# Altium project FMC_DAC_1_5GS_4CH.PrjPCB (part 1 of 4)
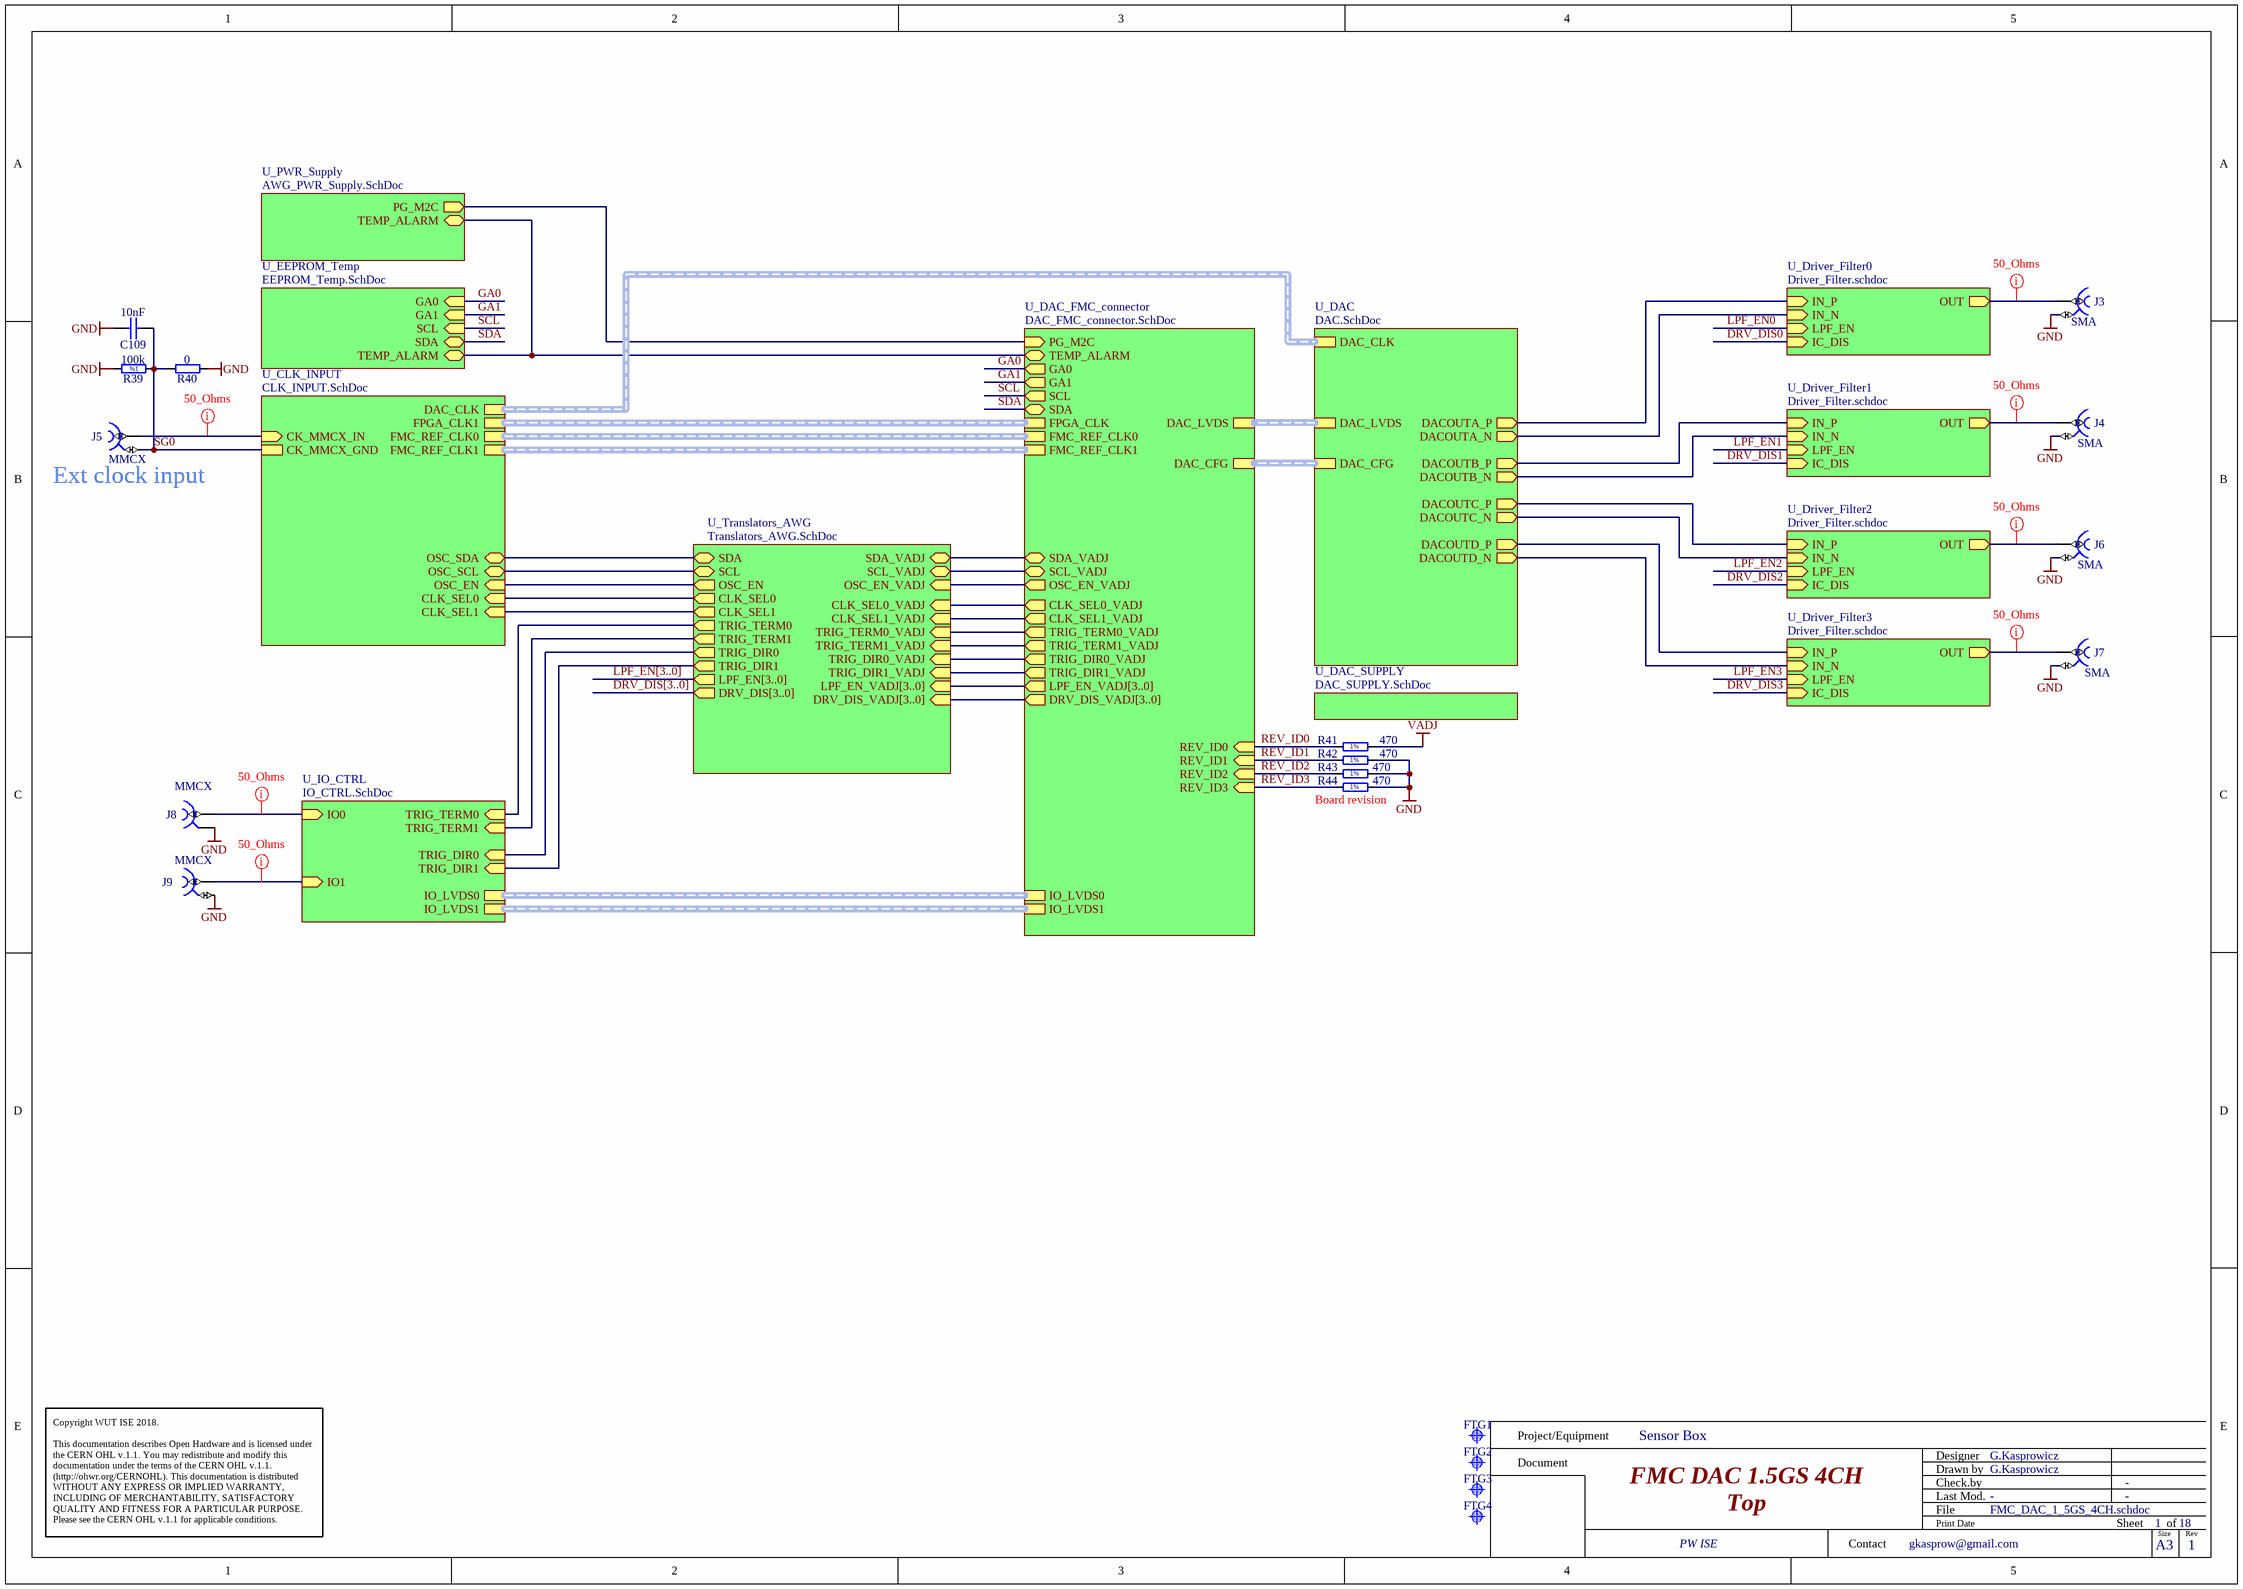
[diagram p0: FMC_DAC_1_5GS_4CH.schdoc]
10 sheets, 355 parts. Net scope: hierarchical (ports join the sheet entries above them; power ports are global).
Board file: FMC_DAC_1_5GS_4CH.PcbDoc
Sheets:
  FMC_DAC_1_5GS_4CH.schdoc
    U_PWR_Supply = AWG_PWR_Supply.SchDoc
    U_CLK_INPUT = CLK_INPUT.SchDoc
    U_DAC = DAC.SchDoc
    U_DAC_SUPPLY = DAC_SUPPLY.SchDoc
    U_DAC_FMC_connector = DAC_FMC_connector.SchDoc
    U_Driver_Filter0 = Driver_Filter.schdoc
    U_Driver_Filter1 = Driver_Filter.schdoc
    U_Driver_Filter2 = Driver_Filter.schdoc
    U_Driver_Filter3 = Driver_Filter.schdoc
    U_EEPROM_Temp = EEPROM_Temp.SchDoc
    U_Translators_AWG = Translators_AWG.SchDoc
    U_IO_CTRL = IO_CTRL.SchDoc

## Sheet FMC_DAC_1_5GS_4CH.schdoc: FMC DAC 1.5GS 4CH
size 420 x 297 mm; EDA_Number: ARTIQ; Projet: ARTIQ/SINARA; Author: G.Kasprowicz; CompanyName: WUT ISE; DrawnBy: G.Kasprowicz; Organization: WUT ISE; Address1: PW ISE; Address2: Nowowiejska 15/19 00-665 Warsaw; Address3: gkasprow@gmail.com; DocumentNumber: 1; Revision: 1; SheetNumber: 1; SheetTotal: 18; ModifiedBy: -; CheckedDate: -; Title2: Top; DivGrp: WUT ISE; Designer: G.Kasprowicz; ModifiedDate: -; ProjectName: Sensor Box

### Parts
C109  10nF  [CAPC1005X55N]
FTG1  Use only in PCB  [FIDUCIAL_TOP_C100-200]  (value not drawn)  (no BOM)
FTG2  Use only in PCB  [FIDUCIAL_TOP_S100-200]  (value not drawn)  (no BOM)
FTG3  Use only in PCB  [FIDUCIAL_TOP_S100-200]  (value not drawn)  (no BOM)
FTG4  Use only in PCB  [FIDUCIAL_TOP_S100-200]  (value not drawn)  (no BOM)
J3  SMA  [AMPHENOL_901-143]
J4  SMA  [AMPHENOL_901-143]
J5  Family: MMCX  [HUBER-SUHNER_85_MMCX-50-0-1/111 OH]  (hidden comment: Coax_1Female_1Shield)
J6  SMA  [AMPHENOL_901-143]
J7  SMA  [AMPHENOL_901-143]
J8  Family: MMCX  [HUBER-SUHNER_85_MMCX-50-0-1/111 OH]  (hidden comment: Coax_1Female_1Shield)
J9  Family: MMCX  [HUBER-SUHNER_85_MMCX-50-0-1/111 OH]  (hidden comment: Coax_1Female_1Shield)
R39  100k  [RESC1005X40N]
R40  0  [RESC1608X55N]
R41  470  [RESC1005X40N]
R42  470  [RESC1005X40N]
R43  470  [RESC1005X40N]
R44  470  [RESC1005X40N]

### Sub-sheets
U_CLK_INPUT = CLK_INPUT.SchDoc: DAC_CLK (harness CLKDIFF), OSC_EN (in), OSC_SCL (bidir), OSC_SDA (bidir), CK_MMCX_GND, CK_MMCX_IN (in), FPGA_CLK1 (harness CLKDIFF), FMC_REF_CLK0 (harness DIFFCLK), CLK_SEL1 (in), FMC_REF_CLK1 (harness DIFFCLK), CLK_SEL0 (in)
U_DAC = DAC.SchDoc: DAC_CFG (harness DAC_CFG), DAC_LVDS (harness DAC_LVDS), DAC_CLK (harness CLKDIFF), DACOUTA_P (out), DACOUTA_N (out), DACOUTB_N (out), DACOUTB_P (out), DACOUTC_P (out), DACOUTC_N (out), DACOUTD_N (out), DACOUTD_P (out)
U_DAC_FMC_connector = DAC_FMC_connector.SchDoc: GA0 (out), GA1 (out), SCL (out), DAC_LVDS (harness DAC_LVDS), DAC_CFG (harness DAC_CFG), SDA (bidir), FPGA_CLK, TEMP_ALARM (bidir), PG_M2C (in), TRIG_DIR0_VADJ (out), TRIG_TERM0_VADJ (out), SDA_VADJ (bidir), SCL_VADJ (bidir), TRIG_DIR1_VADJ (out), TRIG_TERM1_VADJ (out), IO_LVDS0, IO_LVDS1, OSC_EN_VADJ (out), REV_ID0 (in), REV_ID1 (in), REV_ID2 (in), REV_ID3 (in), FMC_REF_CLK0, FMC_REF_CLK1, CLK_SEL0_VADJ (out), CLK_SEL1_VADJ (out), LPF_EN_VADJ[3..0] (out), DRV_DIS_VADJ[3..0] (out)
U_DAC_SUPPLY = DAC_SUPPLY.SchDoc: no entries
U_Driver_Filter0 = Driver_Filter.schdoc: IN_P (in), IN_N (in), OUT (out), LPF_EN (in), IC_DIS (in)
U_Driver_Filter1 = Driver_Filter.schdoc: IN_P (in), IN_N (in), OUT (out), LPF_EN (in), IC_DIS (in)
U_Driver_Filter2 = Driver_Filter.schdoc: IN_P (in), IN_N (in), OUT (out), LPF_EN (in), IC_DIS (in)
U_Driver_Filter3 = Driver_Filter.schdoc: IN_P (in), IN_N (in), OUT (out), LPF_EN (in), IC_DIS (in)
U_EEPROM_Temp = EEPROM_Temp.SchDoc: SDA (bidir), SCL (in), GA0 (in), GA1 (in), TEMP_ALARM (bidir)
U_IO_CTRL = IO_CTRL.SchDoc: TRIG_DIR0 (in), IO0 (in), TRIG_TERM0 (in), IO_LVDS0 (harness DIFFSIG), TRIG_DIR1 (in), IO1 (in), TRIG_TERM1 (in), IO_LVDS1 (harness DIFFSIG)
U_PWR_Supply = AWG_PWR_Supply.SchDoc: PG_M2C (out), TEMP_ALARM (bidir)
U_Translators_AWG = Translators_AWG.SchDoc: SDA_VADJ (bidir), SCL_VADJ (bidir), SDA (bidir), SCL (bidir), OSC_EN (out), TRIG_TERM0 (out), TRIG_TERM1 (out), TRIG_DIR0 (out), TRIG_DIR1 (out), TRIG_DIR0_VADJ (in), TRIG_DIR1_VADJ (in), TRIG_TERM0_VADJ (in), TRIG_TERM1_VADJ (in), OSC_EN_VADJ (in), CLK_SEL0 (out), CLK_SEL1 (out), CLK_SEL1_VADJ (in), CLK_SEL0_VADJ (in), LPF_EN[3..0] (out), DRV_DIS[3..0] (out), LPF_EN_VADJ[3..0] (in), DRV_DIS_VADJ[3..0] (in)

### Nets
GND: C109.2 J3.2 J4.2 J6.2 J7.2 J8.2 J9.2 R39.1 R40.1 R42.2 R43.2 R44.2
VADJ: R41.2
CLK_SEL0: sheet U_CLK_INPUT/CLK_SEL0, sheet U_Translators_AWG/CLK_SEL0
CLK_SEL1: sheet U_CLK_INPUT/CLK_SEL1, sheet U_Translators_AWG/CLK_SEL1
GA0: sheet U_DAC_FMC_connector/GA0, sheet U_EEPROM_Temp/GA0
GA1: sheet U_DAC_FMC_connector/GA1, sheet U_EEPROM_Temp/GA1
HA01_CC_N: sheet U_DAC_FMC_connector/SDA_VADJ, sheet U_Translators_AWG/SDA_VADJ
HA01_CC_P: sheet U_DAC_FMC_connector/SCL_VADJ, sheet U_Translators_AWG/SCL_VADJ
HA02_N: sheet U_DAC_FMC_connector/TRIG_TERM0_VADJ, sheet U_Translators_AWG/TRIG_TERM0_VADJ
HA02_P: sheet U_DAC_FMC_connector/TRIG_TERM1_VADJ, sheet U_Translators_AWG/TRIG_TERM1_VADJ
HA05_P: sheet U_PWR_Supply/TEMP_ALARM, sheet U_DAC_FMC_connector/TEMP_ALARM, sheet U_EEPROM_Temp/TEMP_ALARM
HA06_P: sheet U_DAC_FMC_connector/TRIG_DIR0_VADJ, sheet U_Translators_AWG/TRIG_DIR0_VADJ
HA07_P: sheet U_DAC_FMC_connector/TRIG_DIR1_VADJ, sheet U_Translators_AWG/TRIG_DIR1_VADJ
HA13_N: sheet U_DAC_FMC_connector/OSC_EN_VADJ, sheet U_Translators_AWG/OSC_EN_VADJ
HA16_N: sheet U_DAC_FMC_connector/CLK_SEL1_VADJ, sheet U_Translators_AWG/CLK_SEL1_VADJ
HA16_P: sheet U_DAC_FMC_connector/CLK_SEL0_VADJ, sheet U_Translators_AWG/CLK_SEL0_VADJ
IOUTA_N: sheet U_DAC/DACOUTA_N, sheet U_Driver_Filter0/IN_N
IOUTA_P: sheet U_DAC/DACOUTA_P, sheet U_Driver_Filter0/IN_P
IOUTB_N: sheet U_DAC/DACOUTB_N, sheet U_Driver_Filter1/IN_N
IOUTB_P: sheet U_DAC/DACOUTB_P, sheet U_Driver_Filter1/IN_P
IOUTC_N: sheet U_DAC/DACOUTC_N, sheet U_Driver_Filter2/IN_N
IOUTC_P: sheet U_DAC/DACOUTC_P, sheet U_Driver_Filter2/IN_P
IOUTD_N: sheet U_DAC/DACOUTD_N, sheet U_Driver_Filter3/IN_N
IOUTD_P: sheet U_DAC/DACOUTD_P, sheet U_Driver_Filter3/IN_P
PG_M2C: sheet U_PWR_Supply/PG_M2C, sheet U_DAC_FMC_connector/PG_M2C
REV_ID0: R41.1 ; sheet U_DAC_FMC_connector/REV_ID0  [project net HB09_N]
REV_ID1: R42.1 ; sheet U_DAC_FMC_connector/REV_ID1  [project net HB08_P]
REV_ID2: R43.1 ; sheet U_DAC_FMC_connector/REV_ID2  [project net HB08_N]
REV_ID3: R44.1 ; sheet U_DAC_FMC_connector/REV_ID3  [project net HB13_P]
SCL: sheet U_DAC_FMC_connector/SCL, sheet U_EEPROM_Temp/SCL
SDA: sheet U_DAC_FMC_connector/SDA, sheet U_EEPROM_Temp/SDA
SG0: C109.1 J5.2 R39.2 R40.2 ; sheet U_CLK_INPUT/CK_MMCX_GND
NetC6_2: J5.1 ; sheet U_CLK_INPUT/CK_MMCX_IN
NetD1_3: J8.1 ; sheet U_IO_CTRL/IO0
NetD2_3: J9.1 ; sheet U_IO_CTRL/IO1
NetIC13_13: sheet U_CLK_INPUT/OSC_EN, sheet U_Translators_AWG/OSC_EN
NetIC14_12: sheet U_Translators_AWG/TRIG_TERM1, sheet U_IO_CTRL/TRIG_TERM1
NetIC14_13: sheet U_Translators_AWG/TRIG_TERM0, sheet U_IO_CTRL/TRIG_TERM0
NetIC14_14: sheet U_Translators_AWG/TRIG_DIR1, sheet U_IO_CTRL/TRIG_DIR1
NetIC14_15: sheet U_Translators_AWG/TRIG_DIR0, sheet U_IO_CTRL/TRIG_DIR0
NetIC15_5: sheet U_CLK_INPUT/OSC_SDA, sheet U_Translators_AWG/SDA
NetIC15_6: sheet U_CLK_INPUT/OSC_SCL, sheet U_Translators_AWG/SCL
NetJ3_1: J3.1 ; sheet U_Driver_Filter0/OUT
NetJ4_1: J4.1 ; sheet U_Driver_Filter1/OUT
NetJ6_1: J6.1 ; sheet U_Driver_Filter2/OUT
NetJ7_1: J7.1 ; sheet U_Driver_Filter3/OUT

### Buses and harness runs
bus DRV_DIS[3..0] = sheet U_Translators_AWG/DRV_DIS[3..0]
bus LPF_EN[3..0] = sheet U_Translators_AWG/LPF_EN[3..0]
bus sheet U_DAC_FMC_connector/DRV_DIS_VADJ[3..0] = sheet U_Translators_AWG/DRV_DIS_VADJ[3..0]
bus sheet U_DAC_FMC_connector/LPF_EN_VADJ[3..0] = sheet U_Translators_AWG/LPF_EN_VADJ[3..0]
harness sheet U_CLK_INPUT/DAC_CLK = sheet U_DAC/DAC_CLK
harness sheet U_CLK_INPUT/FMC_REF_CLK0 = sheet U_DAC_FMC_connector/FMC_REF_CLK0
harness sheet U_CLK_INPUT/FMC_REF_CLK1 = sheet U_DAC_FMC_connector/FMC_REF_CLK1
harness sheet U_CLK_INPUT/FPGA_CLK1 = sheet U_DAC_FMC_connector/FPGA_CLK
harness sheet U_DAC/DAC_CFG = sheet U_DAC_FMC_connector/DAC_CFG
harness sheet U_DAC/DAC_LVDS = sheet U_DAC_FMC_connector/DAC_LVDS
harness sheet U_DAC_FMC_connector/IO_LVDS0 = sheet U_IO_CTRL/IO_LVDS0
harness sheet U_DAC_FMC_connector/IO_LVDS1 = sheet U_IO_CTRL/IO_LVDS1

### Layout directives
net class 50_Ohms: NetC6_2, NetD1_3, NetD2_3, NetJ3_1, NetJ4_1, NetJ6_1, NetJ7_1

### Notes on the sheet
- (near J5) Ext clock input
- (near R44) Board revision
- Project/Equipment
- Document
- Designer
- Drawn by
- Check.by
- Copyright WUT ISE 2018.
  This documentation describes Open Hardware and is licensed under the CERN OHL v.1.1. You may redistribute and modify this documentation under the terms of the CERN OHL v.1.1. (http://ohwr.org/CERNOHL). This documentation is distributed WITHOUT ANY EXPRESS OR IMPLIED WARRANTY, INCLUDING OF MERCHANTABILITY, SATISFACTORY QUALITY AND FITNESS FOR A PARTICULAR PURPOSE. Please see the CERN OHL v.1.1 for applicable conditions.
- Contact
- File
- Last Mod.
- Print Date
- Sheet
- Size
- A3
- of
- Rev
- (in symbol R0402_100K_1%_0.0625W_100PPM) 1%
- (in symbol R0402_470R_1%_0.0625W_100PPM) 1%

### Library data of the parts
C109 = CC0402_10NF_16V_10%_X7R: Non-polarised capacitor; Part Description: SMD Multilayer Chip Ceramic Capacitor; Manufacturer: GENERIC; Manufacturer1 Part Number: 223878715636; Voltage: 16V; TC: X7R; Tolerance: ±10%; Part Number: CC0402_10NF_16V_10%_X7R; Component Kind: Standard; Component Type: Standard; Pin Count: 2; Value: 10nF; Status: Not Recommended; Manufacturer Part Number: CC0402_10NF_16V_10%_X7R; Case: 0402; Mounted: Yes; Socket: No; SMD: Yes; Sense: No; Manufacturer1 Example: PHYCOMP; Manufacturer1 ComponentHeight: 0.55mm; HelpURL: \\cern.ch\dfs\Applications\Altium\Datasheets\CC0402_X7R_PHYCOMP.pdf; Author: CERN DEM JLC; CreateDate: 2007-12-03; LatestRevisionDate: 2007-12-03
FTG1 = FIDUCIAL_TARGET_C100-200: Fiducial Target; Part Description: Round Fiducial Target, Top Layer, 1.0mm, Top Solder 2.0mm, Keepout =2.0mm; Mounted: No; Part Number: FIDUCIAL_TARGET_C100-200; Component Type: Standard (No BOM); Pin Count: 1; Family: Fiducial; Socket: No; SMD: Yes; Sense: No; Status: None; ComponentHeight: 0mm; HelpURL: Undefined; Author: CERN DEM JLC; CreateDate: 09.02.2010; LatestRevisionDate: 04.04.2012; PackageDescription: Round Fiducial Target, Top Layer, 1.0mm, Top Solder 2.0mm, Keepout =2.0mm
FTG2-FTG4 = FIDUCIAL_TARGET_S100-200: Fiducial Target; Part Description: Square Fiducial Target, Top Layer, 1.0mm, Top Solder 2.0mm, Keepout =2.0mm; Mounted: No; Part Number: FIDUCIAL_TARGET_S100-200; Component Type: Standard (No BOM); Pin Count: 1; Family: Fiducial; Socket: No; SMD: Yes; Sense: No; Status: None; ComponentHeight: 0mm; HelpURL: Undefined; Author: CERN DEM JLC; CreateDate: 09.02.2010; LatestRevisionDate: 04.04.2012; PackageDescription: Square Fiducial Target, Top Layer, 1.0mm, Top Solder 2.0mm, Keepout =2.0mm
J3 J4 J6 J7 = Coax_1Female_1Shield: Part Description: 50 Ohm Through Hole SMA 90 degrees PCB Jack; Manufacturer: AMPHENOL; Manufacturer Part Number: 901-143; PressFit: No; Part Number: AMPHENOL_901-143; Component Kind: Standard; Component Type: Standard; Pin Count: 5; Family: SMA; Mounted: Yes; Socket: No; SMD: No; Sense: No; Status: None; ComponentHeight: 10.0mm; Author: LNLS DIG GBMB; CreateDate: 31/05/2016; LatestRevisionDate: 31/05/2016
J5 J8 J9 = HUBER-SUHNER_85_MMCX-50-0-1/111 OH: Part Description: MMCX 50 Ohms Right Angle PCB Jack; Manufacturer: HUBER+SUHNER; Table: Miscellaneous; Part Number: HUBER-SUHNER_85_MMCX-50-0-1/111 OH; Component Kind: Standard; Component Type: Standard; Pin Count: 2; Mounted: Yes; Socket: No; SMD: No; Status: None; Manufacturer Part Number: 85_MMCX-50-0-1/111 OH; ComponentHeight: 9.6mm; HelpURL: \\cern.ch\dfs\Applications\Altium\Datasheets\HUBER-SUHNER_85_MMCX-50-0-1-111 OH.pdf; Author: CERN DEM JLC; CreateDate: 2011-10-04; LatestRevisionDate: 2011-10-04
R39 = R0402_100K_1%_0.0625W_100PPM: Resistor - 1%; Part Description: General Purpose Thick Film Chip Resistor; Manufacturer: GENERIC; Manufacturer1 Part Number: 232270671004L; PressFit: No; TC: ±100ppm/°C; Part Number: R0402_100K_1%_0.0625W_100PPM; Component Kind: Standard; Component Type: Standard; Pin Count: 2; Value: 100k; Status: Not Recommended; Manufacturer Part Number: R0402_100K_1%_0.0625W_100PPM; Case: 0402; Mounted: Yes; Sense: No; Socket: No; SMD: Yes; Manufacturer1 Example: YAGEO PHYCOMP; Manufacturer1 ComponentHeight: 0.4mm; HelpURL: \\cern.ch\dfs\Applications\Altium\Datasheets\R0402_Phycomp_RC0402.pdf; Author: CERN DEM JLC; CreateDate: 03.12.2007; LatestRevisionDate: 17.10.2012; Power: 0.0625W; Tolerance: ±1%
R40 = R0603_0R_JUMPER: Resistor; Part Description: 1A (0.05R Max DC Resistance) Zero Ohm Jumper; Manufacturer: GENERIC; Manufacturer1 Part Number: NRC06Z0; PressFit: No; Part Number: R0603_0R_JUMPER; Component Kind: Standard; Component Type: Standard; Pin Count: 2; Value: 0; Status: Preferred; Manufacturer Part Number: R0603_0R_JUMPER; Case: 0603; Mounted: Yes; Sense: No; Socket: No; SMD: Yes; Manufacturer1 Example: NIC COMPONENT; Manufacturer1 ComponentHeight: 0.55mm; HelpURL: \\cern.ch\dfs\Applications\Altium\Datasheets\R0603_NIC_NRC.pdf; Author: CERN DEM JLC; CreateDate: 03.12.2007; LatestRevisionDate: 13.03.2008
R41-R44 = R0402_470R_1%_0.0625W_100PPM: Resistor - 1%; Part Description: General Purpose Thick Film Chip Resistor; Manufacturer: GENERIC; Manufacturer1 Part Number: 232270674701L; TC: ±100ppm/°C; PressFit: No; Part Number: R0402_470R_1%_0.0625W_100PPM; Component Kind: Standard; Component Type: Standard; Pin Count: 2; Value: 470; Status: Not Recommended; Power: 0.0625W; Tolerance: ±1%; Manufacturer Part Number: R0402_470R_1%_0.0625W_100PPM; Case: 0402; Mounted: Yes; Sense: No; Socket: No; SMD: Yes; Manufacturer1 Example: YAGEO PHYCOMP; Manufacturer1 ComponentHeight: 0.4mm; HelpURL: \\cern.ch\dfs\Applications\Altium\Datasheets\R0402_Phycomp_RC0402.pdf; Author: CERN DEM JLC; CreateDate: 03.12.2007; LatestRevisionDate: 17.10.2012

## Sheet AWG_PWR_Supply.SchDoc: FMC DAC 1.5GS 4CH
size 420 x 297 mm; Author: G.Kasprowicz; CompanyName: WUT ISE; DrawnBy: G.Kasprowicz; Organization: WUT ISE; Address1: PW ISE; Address2: Nowowiejska 15/19 00-665 Warsaw; Address3: gkasprow@gmail.com; DocumentNumber: 17; Revision: 1; SheetNumber: 17; SheetTotal: 18; ModifiedBy: -; CheckedDate: -; Title2: P5V5 power rail and converters; DivGrp: WUT ISE; Designer: G.Kasprowicz; ModifiedDate: -; ProjectName: Sensor Box
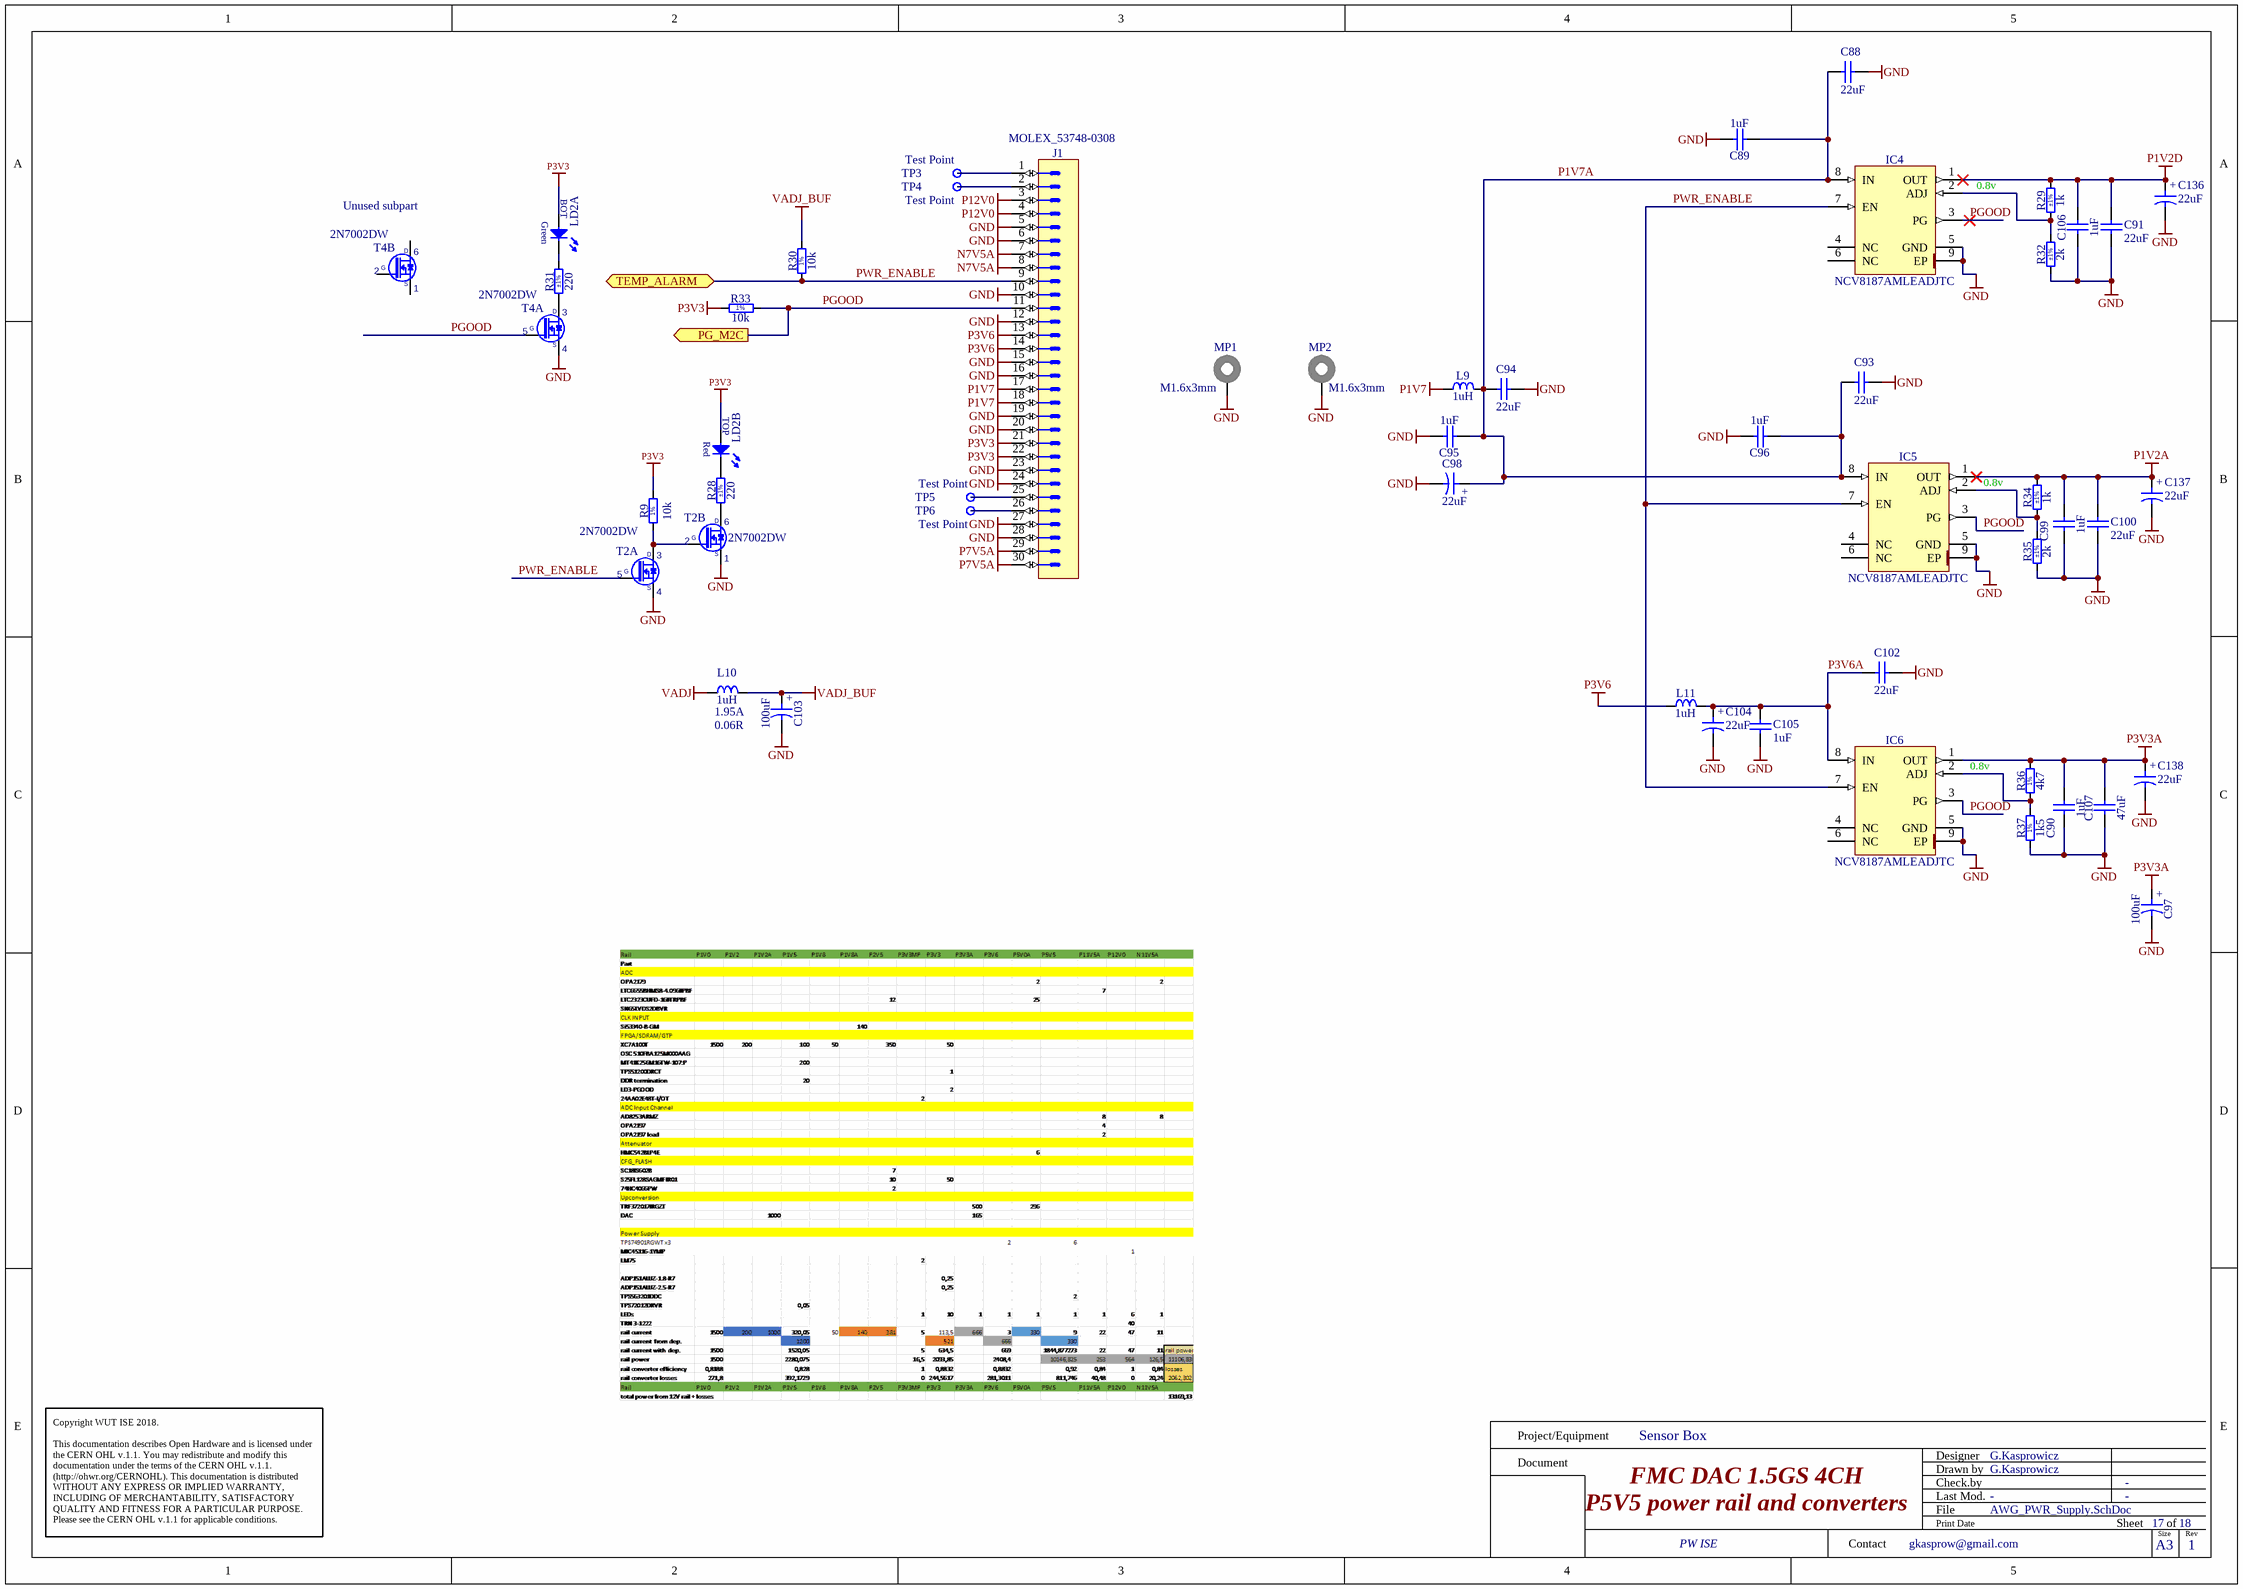
[diagram p1: AWG_PWR_Supply.SchDoc]

### Parts
C88  22uF  [CAPC2012X135N]
C89  1uF  [CAPC1005X55N]
C90  1uF  [CAPC1005X55N]
C91  22uF  [CAPC2012X135N]
C93  22uF  [CAPC2012X135N]
C94  22uF  [CAPC2012X135N]
C95  1uF  [CAPC1005X55N]
C96  1uF  [CAPC1005X55N]
C97  100uF  [CAPMP3216X180N]
C98  22uF  [CAPMP3528X210N]
C99  1uF  [CAPC1005X55N]
C100  22uF  [CAPC2012X135N]
C102  22uF  [CAPC2012X135N]
C103  100uF  [CAPMP3216X180N]
C104  22uF  [CAPMP3528X210N]
C105  1uF  [CAPC1005X55N]
C106  1uF  [CAPC1005X55N]
C107  47uF  [CAPC3225X270N]
C136  22uF  [CAPMP3528X210N]
C137  22uF  [CAPMP3528X210N]
C138  22uF  [CAPMP3528X210N]
IC4  NCV8187AMLEADJTC  [SON50P300X300X100-9N-R175X250]
IC5  NCV8187AMLEADJTC  [SON50P300X300X100-9N-R175X250]
IC6  NCV8187AMLEADJTC  [SON50P300X300X100-9N-R175X250]
J1  SlimStack™  [MOLEX_53748-0308]  (value not drawn)
L9  1uH  [INDC2620X100N]
L10  1uH  Power: 1.95A  Resistance: 0.06R  [INDC2620X100N]
L11  1uH  [INDC2620X100N]
LD2  Red/Green  [LED_DIALIGHT_571-0112F]  (value not drawn)  (parts A,B of 2)
MP1  M1.6x3mm  [9774030633]
MP2  M1.6x3mm  [9774030633]
R9  10k  [RESC1005X40N]
R28  220  Tolerance: ±1%  [RESC1005X40N]
R29  1k  Tolerance: ±1%  [RESC1005X40N]
R30  10k  [RESC1005X40N]
R31  220  Tolerance: ±1%  [RESC1005X40N]
R32  2k  Tolerance: ±1%  [RESC1005X40N]
R33  10k  [RESC1005X40N]
R34  1k  Tolerance: ±1%  [RESC1005X40N]
R35  2k  Tolerance: ±1%  [RESC1005X40N]
R36  4k7  [RESC1608X55N]
R37  1k5  [RESC1608X55N]
T2  2N7002DW  [SOT65P210X110-6N]  (parts A,B of 2)
T4  2N7002DW  [SOT65P210X110-6N]  (parts A,B of 2)
TP3  Test Point  [TPS127]  (no BOM)
TP4  Test Point  [TPS127]  (no BOM)
TP5  Test Point  [TPS127]  (no BOM)
TP6  Test Point  [TPS127]  (no BOM)

### Ports
PG_M2C (out), TEMP_ALARM (bidir)

### Nets
GND: C88.1 C89.2 C90.1 C91.2 C93.1 C94.1 C95.2 C96.2 C97.2 C98.2 C99.1 C100.2 C102.1 C103.2 C104.2 C105.2 C106.1 C107.1 C136.2 C137.2 C138.2 IC4.5(GND) IC4.9(EP) IC5.5(GND) IC5.9(EP) IC6.5(GND) IC6.9(EP) J1.5 J1.6 J1.10 J1.12 J1.15 J1.16 J1.19 J1.20 J1.23 J1.24 J1.27 J1.28 MP1.1 MP2.1 R32.1 R35.1 R37.1 T2.1(S2) T2.4(S1) T4.4(S1)
N7V5A: J1.7 J1.8
P1V2A: C99.2 C100.1 C137.1 IC5.1(OUT) R34.2
P1V2D: C91.1 C106.2 C136.1 IC4.1(OUT) R29.2
P1V7: J1.17 J1.18 L9.1
P3V3: J1.21 J1.22 LD2.2(A) LD2.4(A) R9.2 R33.1
P3V3A: C90.2 C97.1 C107.2 C138.1 IC6.1(OUT) R36.2
P3V6: J1.13 J1.14 L11.1
P7V5A: J1.29 J1.30
P12V0: J1.3 J1.4
VADJ: L10.1
VADJ_BUF: C103.1 L10.2 R30.2
P1V7A: C88.2 C89.1 C93.2 C94.2 C95.1 C96.1 C98.1 IC4.8(IN) IC5.8(IN) L9.2
P3V6A: C102.2 C104.1 C105.1 IC6.8(IN) L11.2
PGOOD: IC4.3(PG) IC5.3(PG) IC6.3(PG) J1.11 R33.2 T4.5(G1) ; port PG_M2C  [project net PG_M2C]
PWR_ENABLE: IC4.7(EN) IC5.7(EN) IC6.7(EN) J1.9 R30.1 T2.5(G1) ; port TEMP_ALARM  [project net HA05_P]
NetIC4_2: IC4.2(ADJ) R29.1 R32.2
NetIC5_2: IC5.2(ADJ) R34.1 R35.2
NetIC6_2: IC6.2(ADJ) R36.1 R37.2
NetJ1_1: J1.1 TP3.1
NetJ1_2: J1.2 TP4.1
NetJ1_25: J1.25 TP5.1
NetJ1_26: J1.26 TP6.1
NetLD2_1: LD2.1(C) R31.2
NetLD2_3: LD2.3(C) R28.2
NetR9_1: R9.1 T2.2(G2) T2.3(D1)
NetR28_1: R28.1 T2.6(D2)
NetR31_1: R31.1 T4.3(D1)

Not connected (* = marked no-connect by the designer): IC4 4(NC) 6(NC); IC5 4(NC) 6(NC); IC6 4(NC) 6(NC); T4 1(S2) 2(G2) 6(D2)

### Notes on the sheet
- 0.8v
- (near T4) Unused subpart
- Project/Equipment
- Document
- Designer
- Drawn by
- Check.by
- Copyright WUT ISE 2018.
  This documentation describes Open Hardware and is licensed under the CERN OHL v.1.1. You may redistribute and modify this documentation under the terms of the CERN OHL v.1.1. (http://ohwr.org/CERNOHL). This documentation is distributed WITHOUT ANY EXPRESS OR IMPLIED WARRANTY, INCLUDING OF MERCHANTABILITY, SATISFACTORY QUALITY AND FITNESS FOR A PARTICULAR PURPOSE. Please see the CERN OHL v.1.1 for applicable conditions.
- Contact
- File
- Last Mod.
- Print Date
- Sheet
- Size
- A3
- of
- Rev
- (in symbol 2N7002DW, part A) D; G; S
- (in symbol 2N7002DW, part B) D; G; S
- (in symbol CTE3216-18_100UF_6.3V_20%_ESR0500_AVX_TLJ) +
- (in symbol CTE3528-21_22UF_10V_10%_LESR0700) +
- (in symbol LED_DIALIGHT_571-0112F, part A) BOT; Green
- (in symbol LED_DIALIGHT_571-0112F, part B) TOP; Red
- (in symbol R0402_10K_1%_0.0625W_100PPM) 1%
- (in symbol R0603_1K5_1%_0.1W_100PPM) 1%
- (in symbol R0603_4K7_1%_0.1W_100PPM) 1%

### Library data of the parts
C88 C91 C93 C94 C100 C102 = CC0805_22UF_16V_10%_X5R: Non-polarised capacitor; Part Description: SMD Multilayer Chip Ceramic Capacitor; Manufacturer: GENERIC; Manufacturer1 Part Number: C2012X5R1C226KT; Voltage: 16V; TC: X5R; Tolerance: ±10%; Part Number: CC0805_22UF_16V_10%_X5R; Component Kind: Standard; Component Type: Standard; Pin Count: 2; Value: 22uF; Status: Preferred; Manufacturer Part Number: CC0805_22UF_16V_10%_X5R; Case: 0805; Mounted: Yes; Socket: No; SMD: Yes; Sense: No; Manufacturer1 Example: TDK; Manufacturer1 ComponentHeight: 1.35mm; HelpURL: \\cern.ch\dfs\Applications\Altium\Datasheets\CC0805_X5R_TDK_C.pdf; Author: CERN DEM JLC; CreateDate: 25.10.2012; LatestRevisionDate: 25.10.2012
C89 C90 C95 C96 C99 C105 C106 = CC0402_1UF_16V_10%_X5R: Non-polarised capacitor; Part Description: SMD Multilayer Chip Ceramic Capacitor; Manufacturer: GENERIC; Manufacturer1 Part Number: C1005X5R1C105KT; Voltage: 16V; TC: X5R; Tolerance: ±10%; Part Number: CC0402_1UF_16V_10%_X5R; Component Kind: Standard; Component Type: Standard; Pin Count: 2; Value: 1uF; Status: Preferred; Manufacturer Part Number: CC0402_1UF_16V_10%_X5R; Case: 0402; Mounted: Yes; Socket: No; SMD: Yes; Sense: No; Manufacturer1 Example: TDK; Manufacturer1 ComponentHeight: 0.55mm; HelpURL: \\cern.ch\dfs\Applications\Altium\Datasheets\CC0402_X5R_TDK_C.pdf; Author: CERN DEM JLC; CreateDate: 2012-10-25; LatestRevisionDate: 2012-10-25
C97 C103 = CTE3216-18_100UF_6.3V_20%_ESR0500_AVX_TLJ: Polarised capacitor; Part Description: ESR 0R5 Solid Tantalum Chip Capacitor; Manufacturer: AVX; Manufacturer Part Number: TLJA107M006R0500; Voltage: 6.3V; Tolerance: ±20%; Part Number: CTE3216-18_100UF_6.3V_20%_ESR0500_AVX_TLJ; Component Kind: Standard; Component Type: Standard; Pin Count: 2; Value: 100uF; Status: None; Case: A; Mounted: Yes; Socket: No; SMD: Yes; Sense: No; HelpURL: \\cern.ch\dfs\Applications\Altium\Datasheets\CTE_AVX_TLJ.pdf; Author: CERN DEM JLC; CreateDate: 19.12.2013; LatestRevisionDate: 19.12.2013; ComponentHeight: 1.8mm
C98 C104 C136-C138 = CTE3528-21_22UF_10V_10%_LESR0700: Polarised capacitor; Part Description: Low ESR 0R7 Solid Tantalum Chip Capacitor; Manufacturer: GENERIC; Manufacturer1 Part Number: TPSB226K010R0700; Voltage: 10V; Tolerance: ±10%; Part Number: CTE3528-21_22UF_10V_10%_LESR0700; Component Kind: Standard; Component Type: Standard; Pin Count: 2; Value: 22uF; Status: Preferred; Manufacturer Part Number: CTE3528-21_22UF_10V_10%_LESR0700; Case: B; Mounted: Yes; Socket: No; SMD: Yes; Sense: No; Manufacturer1 Example: AVX; Manufacturer1 ComponentHeight: 2.1mm; HelpURL: \\cern.ch\dfs\Applications\Altium\Datasheets\CTE-LESR_AVX_TPS.pdf; Author: CERN DEM JLC; CreateDate: 05.05.2008; LatestRevisionDate: 20.01.2009
C107 = CC1210_47UF_10V_20%_X5R: Non-polarised capacitor; Part Description: SMD Multilayer Chip Ceramic Capacitor; Manufacturer: GENERIC; Manufacturer1 Part Number: LMK325BJ476MM-T; Voltage: 10V; TC: X5R; Tolerance: ±20%; Part Number: CC1210_47UF_10V_20%_X5R; Component Kind: Standard; Component Type: Standard; Pin Count: 2; Value: 47uF; Status: None; Manufacturer Part Number: CC1210_47UF_10V_20%_X5R; Case: 1210; Mounted: Yes; Socket: No; SMD: Yes; Sense: No; Manufacturer1 Example: TAIYO YUDEN; Manufacturer1 ComponentHeight: 2.7mm; HelpURL: \\cern.ch\dfs\Applications\Altium\Datasheets\CC1210_X5R_TAIYO-YUDEN_HIGH-VALUE.pdf; Author: CERN DEM JLC; CreateDate: 04.05.2011; LatestRevisionDate: 04.05.2011
IC4-IC6 = NCV8187AMLEADJTC: Adjustable, 1.2A, Voltage Regulator - Low Iq, Low Dropout, Power Good Output; Manufacturer: ON SEMICONDUCTOR; PressFit: No; Bonding: No; Part Number: NCV8187AMLEADJTC; Component Kind: Standard; Component Type: Standard; Device: NCV8187AMLEADJTC; PackageDescription: SON, (DFN) 0.50mm Pitch; 8 Pin, 3.00mm W X 3.00mm L X 1.00mm H body (w/Thermal Tab 1.75 X 2.50mm), IPC Medium Density; Part Description: Adjustable, 1.2A, Voltage Regulator - Low Iq, Low Dropout, Power Good Output; Manufacturer Part Number: NCV8187AMLEADJTC; Pin Count: 9; Case: SON8; Mounted: Yes; Socket: No; SMD: Yes; Sense: No; ComponentHeight: 1mm; HelpURL: \\cern.ch\dfs\Applications\Altium\Datasheets\NCV8187.pdf; Author: CERN DEM HF; CreateDate: 18.05.2022; LatestRevisionDate: 18.05.2022
J1 = MOLEX_53748-0308: Connector 30 Male; Part Description: 0.50mm Pitch SlimStack™ Dual Row 30 Circuits Surface Mount Vertical Plug (3.00 Stacking Heights); Manufacturer: MOLEX; PressFit: No; Part Number: MOLEX_53748-0308; Component Kind: Standard; Component Type: Standard; Pin Count: 30; Family: SlimStack™; Mounted: Yes; Socket: No; SMD: Yes; Sense: No; Status: None; Manufacturer Part Number: 53748-0308; ComponentHeight: 2.4mm; HelpURL: \\cern.ch\dfs\Applications\Altium\Datasheets\MOLEX_53748-0308.pdf; Author: CERN DEM JLC; CreateDate: 28.08.2012; LatestRevisionDate: 28.08.2012
L9 L11 = IND1008_1UH_20%_WURTH_74479787210B: Inductor; Part Description: Power Multilayer Inductor (WE-PMI Series); Manufacturer: WURTH ELEKTRONIK; Power: 1.95A; Resistance: 0.06R; Tolerance: ±20%; Part Number: IND1008_1UH_20%_WURTH_74479787210B; Component Kind: Standard; Component Type: Standard; Pin Count: 2; Value: 1uH; Status: None; Manufacturer Part Number: 74479787210B; Mounted: Yes; Socket: No; SMD: Yes; Sense: No; ComponentHeight: 1mm; HelpURL: \\cern.ch\dfs\Applications\Altium\Datasheets\IND_WURTH_WE-PMI_74479787210B.pdf; Author: CERN DEM JLC; CreateDate: 01.10.2014; LatestRevisionDate: 01.10.2014; Case: 1008
L10 = IND1008_1UH_20%_WURTH_74479787210B: Inductor; Part Description: Power Multilayer Inductor (WE-PMI Series); Manufacturer: WURTH ELEKTRONIK; Tolerance: ±20%; Part Number: IND1008_1UH_20%_WURTH_74479787210B; Component Kind: Standard; Component Type: Standard; Pin Count: 2; Value: 1uH; Status: None; Manufacturer Part Number: 74479787210B; Mounted: Yes; Socket: No; SMD: Yes; Sense: No; ComponentHeight: 1mm; HelpURL: \\cern.ch\dfs\Applications\Altium\Datasheets\IND_WURTH_WE-PMI_74479787210B.pdf; Author: CERN DEM JLC; CreateDate: 01.10.2014; LatestRevisionDate: 01.10.2014; Case: 1008
LD2 = LED_DIALIGHT_571-0112F: 2x LED Botom Green, Top Red; Part Description: Dual 2mm  LEDs, Red Top,Green Bot, CBI® Circuit Board Indicator (Without positioning pins); PressFit: No; Bonding: No; Part Number: LED_DIALIGHT_571-0112F; Component Kind: Standard; Component Type: Standard; Color: Red/Green; PackageDescription: 2x 2mm LED (Top: Red, Bot: Green) PCB Edge Mounting (Without positioning pins) DIALIGHT 571 Serie; Manufacturer: DIALIGHT; Manufacturer Part Number: 571-0112F; Pin Count: 4; Mounted: Yes; Socket: No; SMD: No; Sense: No; ComponentHeight: 8.6mm; HelpURL: \\cern.ch\dfs\Applications\Altium\Datasheets\LED_DIALIGHT_571-0112F.pdf; Author: CERN DEM JLC; CreateDate: 09.11.2009; LatestRevisionDate: 17.03.2010
MP1 MP2 = 9774030633R: WA-SMSI SMT Steel Spacer, M1.6 Thread Internal, OD 3.3mm, M1.6x3mm; Manufacturer: Wurth Elektronik; Inner Diameter: 1.9mm; Surface: Tin; ComponentLink1Description: Manufacturer; ComponentLink1URL: http://www.we-online.de; ComponentLink2Description: Datasheet; ComponentLink2URL: https://www.we-online.com/catalog/datasheet/9774030633R.pdf; Mounting Technology: SMT; Packaging: Tape and Reel; Manufacturer Part Number: 9774030633R; Length: 3mm; Inner Thread Length: -; Operating Temperature: -55 to +150degC; Outer Diameter: 3.3mm; Published Date: April 2020; Material: Steel; Thread: M1.6
R9 R30 = R0402_10K_1%_0.0625W_100PPM: Resistor - 1%; Part Description: General Purpose Thick Film Chip Resistor; Manufacturer: GENERIC; Manufacturer1 Part Number: 232270671003L; TC: ±100ppm/°C; Table: Resistors SMD; Part Number: R0402_10K_1%_0.0625W_100PPM; Component Kind: Standard; Component Type: Standard; Pin Count: 2; Value: 10k; Status: Not recommended; Power: 0.0625W; Tolerance: ±1%; Manufacturer Part Number: R0402_10K_1%_0.0625W_100PPM; Case: 0402; Mounted: Yes; Socket: No; SMD: Yes; Manufacturer1 Example: YAGEO PHYCOMP; Manufacturer1 ComponentHeight: 0.4mm; HelpURL: \\cern.ch\dfs\Applications\Altium\Datasheets\R0402_Phycomp_RC0402.pdf; Author: CERN DEM JLC; CreateDate: 3/12/2007; LatestRevisionDate: 17/10/2012
R28 R31 = R0402_220R_1%_0.0625W_100PPM: Resistor - 1%; Part Description: General Purpose Thick Film Chip Resistor; Manufacturer: GENERIC; Manufacturer1 Part Number: 232270672201L; TC: ±100ppm/°C; PressFit: No; Part Number: R0402_220R_1%_0.0625W_100PPM; Component Kind: Standard; Component Type: Standard; Pin Count: 2; Value: 220; Status: Not Recommended; Power: 0.0625W; Manufacturer Part Number: R0402_220R_1%_0.0625W_100PPM; Case: 0402; Mounted: Yes; Sense: No; Socket: No; SMD: Yes; Manufacturer1 Example: YAGEO PHYCOMP; Manufacturer1 ComponentHeight: 0.4mm; HelpURL: \\cern.ch\dfs\Applications\Altium\Datasheets\R0402_Phycomp_RC0402.pdf; Author: CERN DEM JLC; CreateDate: 03.12.2007; LatestRevisionDate: 17.10.2012
R29 R34 = R0402_1K_1%_0.0625W_100PPM: Resistor - 1%; Part Description: General Purpose Thick Film Chip Resistor; Manufacturer: GENERIC; Manufacturer1 Part Number: 232270671002L; TC: ±100ppm/°C; PressFit: No; Part Number: R0402_1K_1%_0.0625W_100PPM; Component Kind: Standard; Component Type: Standard; Pin Count: 2; Value: 1k; Status: Not Recommended; Power: 0.0625W; Manufacturer Part Number: R0402_1K_1%_0.0625W_100PPM; Case: 0402; Mounted: Yes; Sense: No; Socket: No; SMD: Yes; Manufacturer1 Example: YAGEO PHYCOMP; Manufacturer1 ComponentHeight: 0.4mm; HelpURL: \\cern.ch\dfs\Applications\Altium\Datasheets\R0402_Phycomp_RC0402.pdf; Author: CERN DEM JLC; CreateDate: 03.12.2007; LatestRevisionDate: 17.10.2012
R32 R35 = R0402_2K_1%_0.0625W_100PPM: Resistor - 1%; Part Description: General Purpose Thick Film Chip Resistor; Manufacturer: GENERIC; Manufacturer1 Part Number: 232270672002L; TC: ±100ppm/°C; PressFit: No; Part Number: R0402_2K_1%_0.0625W_100PPM; Component Kind: Standard; Component Type: Standard; Pin Count: 2; Value: 2k; Status: Not Recommended; Power: 0.0625W; Manufacturer Part Number: R0402_2K_1%_0.0625W_100PPM; Case: 0402; Mounted: Yes; Sense: No; Socket: No; SMD: Yes; Manufacturer1 Example: YAGEO PHYCOMP; Manufacturer1 ComponentHeight: 0.4mm; HelpURL: \\cern.ch\dfs\Applications\Altium\Datasheets\R0402_Phycomp_RC0402.pdf; Author: CERN DEM JLC; CreateDate: 03.12.2007; LatestRevisionDate: 17.10.2012
R33 = R0402_10K_1%_0.0625W_100PPM: Resistor - 1%; Part Description: General Purpose Thick Film Chip Resistor; Manufacturer: GENERIC; Manufacturer1 Part Number: 232270671003L; TC: ±100ppm/°C; PressFit: No; Part Number: R0402_10K_1%_0.0625W_100PPM; Component Kind: Standard; Component Type: Standard; Pin Count: 2; Value: 10k; Status: Not Recommended; Power: 0.0625W; Tolerance: ±1%; Manufacturer Part Number: R0402_10K_1%_0.0625W_100PPM; Case: 0402; Mounted: Yes; Sense: No; Socket: No; SMD: Yes; Manufacturer1 Example: YAGEO PHYCOMP; Manufacturer1 ComponentHeight: 0.4mm; HelpURL: \\cern.ch\dfs\Applications\Altium\Datasheets\R0402_Phycomp_RC0402.pdf; Author: CERN DEM JLC; CreateDate: 03.12.2007; LatestRevisionDate: 17.10.2012
R36 = R0603_4K7_1%_0.1W_100PPM: Resistor - 1%; Part Description: General Purpose Thick Film Chip Resistor; Manufacturer: GENERIC; Manufacturer1 Part Number: NRC06F4701TRF; Power: 0.1W; TC: ±100ppm/°C; PressFit: No; Part Number: R0603_4K7_1%_0.1W_100PPM; Component Kind: Standard; Component Type: Standard; Pin Count: 2; Value: 4k7; Status: Preferred; Tolerance: ±1%; Manufacturer Part Number: R0603_4K7_1%_0.1W_100PPM; Case: 0603; Mounted: Yes; Sense: No; Socket: No; SMD: Yes; Manufacturer1 Example: NIC COMPONENT; Manufacturer1 ComponentHeight: 0.55mm; HelpURL: \\cern.ch\dfs\Applications\Altium\Datasheets\R0603_NIC_NRC.pdf; Author: CERN DEM JLC; CreateDate: 03.12.2007; LatestRevisionDate: 13.03.2008
R37 = R0603_1K5_1%_0.1W_100PPM: Resistor - 1%; Part Description: General Purpose Thick Film Chip Resistor; Manufacturer: GENERIC; Manufacturer1 Part Number: NRC06F1501TRF; Power: 0.1W; TC: ±100ppm/°C; PressFit: No; Part Number: R0603_1K5_1%_0.1W_100PPM; Component Kind: Standard; Component Type: Standard; Pin Count: 2; Value: 1k5; Status: Preferred; Tolerance: ±1%; Manufacturer Part Number: R0603_1K5_1%_0.1W_100PPM; Case: 0603; Mounted: Yes; Sense: No; Socket: No; SMD: Yes; Manufacturer1 Example: NIC COMPONENT; Manufacturer1 ComponentHeight: 0.55mm; HelpURL: \\cern.ch\dfs\Applications\Altium\Datasheets\R0603_NIC_NRC.pdf; Author: CERN DEM JLC; CreateDate: 03.12.2007; LatestRevisionDate: 13.03.2008
T2 T4 = 2N7002DW: 60 V, 115 mA, Dual N-Channel Field Effect Transistor, Enhancement Mode; Part Description: 60V 115mA Dual N-Channel Field Effect Transistor, Enhancement Mode; Manufacturer: ON SEMICONDUCTOR; PressFit: No; Bonding: No; Part Number: 2N7002DW; Component Kind: Standard; Component Type: Standard; Device: 2N7002DW; PackageDescription: SOT363, SC70-6, 0.65mm Pitch; 6 Pin, 1.25mm W X 2.00mm L X 1.10mm H body, IPC Medium Density; Manufacturer Part Number: 2N7002DW; Pin Count: 6; Case: SOT363; Mounted: Yes; Socket: No; SMD: Yes; Sense: No; ComponentHeight: 1.1mm; HelpURL: \\cern.ch\dfs\Applications\Altium\Datasheets\2N7002DW.pdf; Author: CERN DEM BC; CreateDate: 25.11.2020; LatestRevisionDate: 25.11.2020
TP3-TP6 = SMD_PAD_1.27X1.27MM: Part Description: 1.27mm x 1.27mm PCB Copper Area (SMD Test Point); Mounted: No; Part Number: SMD_PAD_1.27X1.27MM; Component Type: Standard (No BOM); Pin Count: 1; Family: Test Point; Socket: No; SMD: Yes; Sense: No; Status: None; ComponentHeight: 0mm; HelpURL: Undefined; Author: CERN DEM JLC; CreateDate: 12.01.2008; LatestRevisionDate: 12.01.2008; PackageDescription: 1.27mm x 1.27mm PCB Copper Area (SMD Test Point)

## Sheet CLK_INPUT.SchDoc: FMC DAC 1.5GS 4CH
size 420 x 297 mm; EDA_Number: ARTIQ; Projet: ARTIQ/SINARA; Author: G.Kasprowicz; CompanyName: WUT ISE; DrawnBy: G.Kasprowicz; Organization: WUT ISE; Address1: PW ISE; Address2: Nowowiejska 15/19 00-665 Warsaw; Address3: gkasprow@gmail.com; DocumentNumber: 5; Revision: 1; SheetNumber: 5; SheetTotal: 18; ModifiedBy: -; CheckedDate: -; Title2: Clock distribution; DivGrp: WUT ISE; Designer: G.Kasprowicz; ModifiedDate: -; ProjectName: Sensor Box
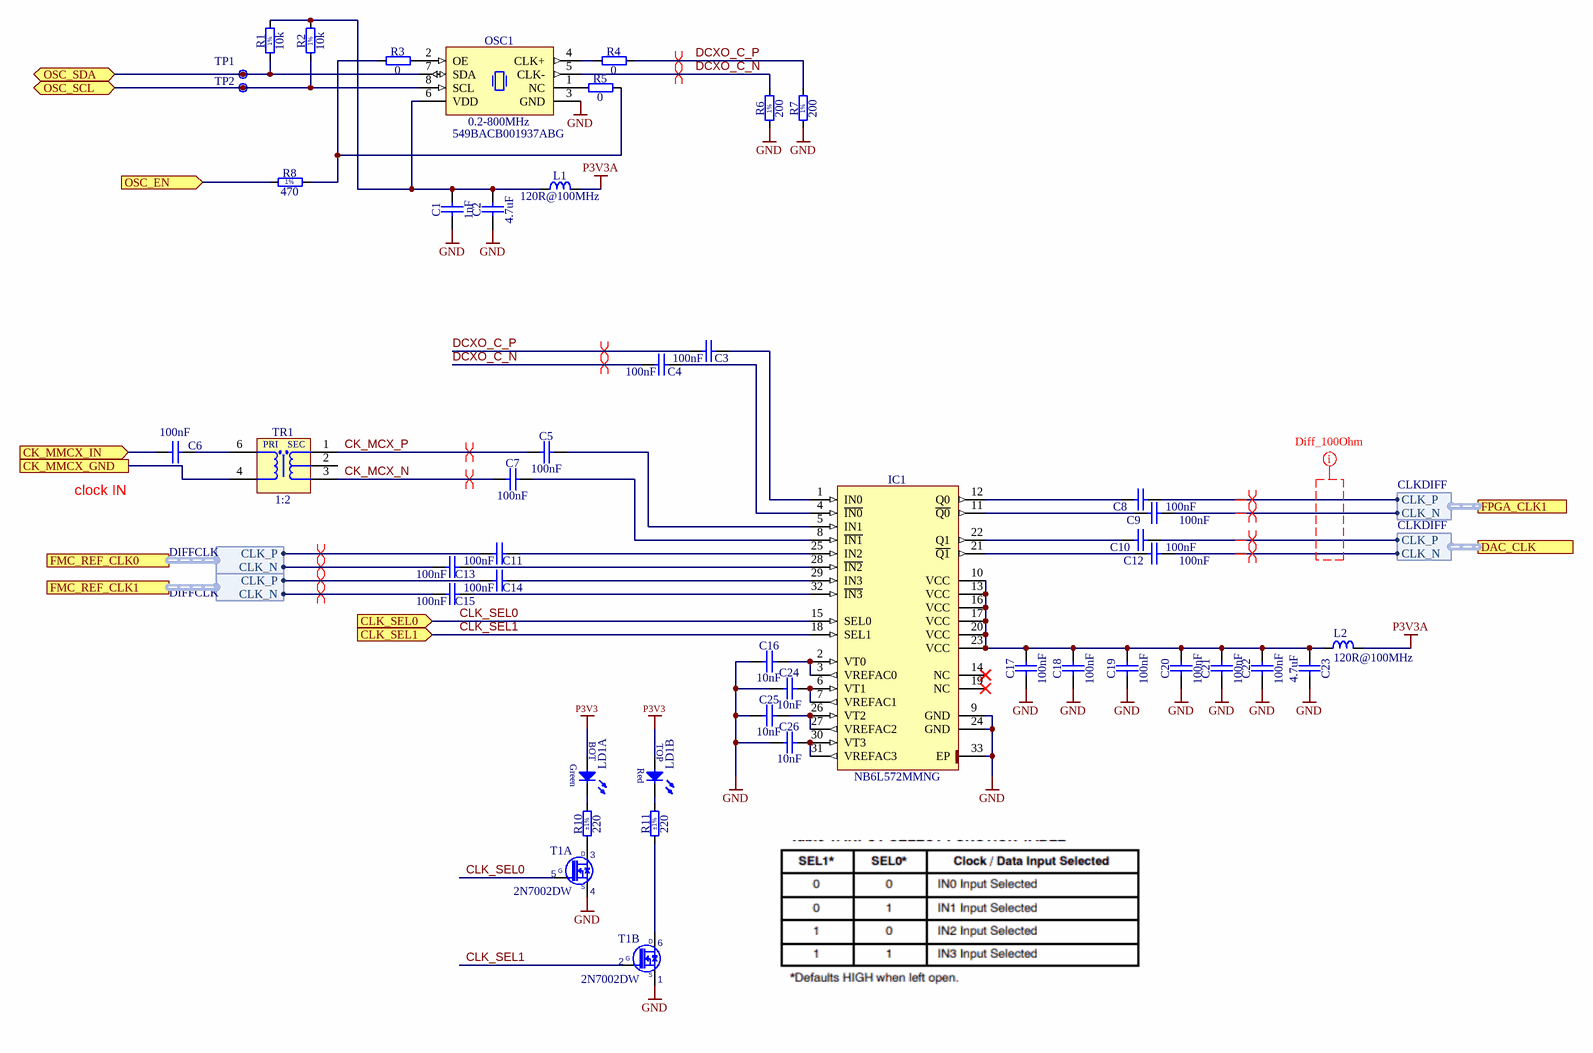
[diagram p2: CLK_INPUT.SchDoc]

### Parts
C1  1nF  [CAPC1005X55N]
C2  4.7uF  [CAPC2012X135N]
C3  100nF  [CAPC0603X33N]
C4  100nF  [CAPC0603X33N]
C5  100nF  [CAPC0603X33N]
C6  100nF  [CAPC0603X33N]
C7  100nF  [CAPC0603X33N]
C8  100nF  [CAPC0603X33N]
C9  100nF  [CAPC0603X33N]
C10  100nF  [CAPC0603X33N]
C11  100nF  [CAPC0603X33N]
C12  100nF  [CAPC0603X33N]
C13  100nF  [CAPC0603X33N]
C14  100nF  [CAPC0603X33N]
C15  100nF  [CAPC0603X33N]
C16  10nF  [CAPC1005X55N]
C17  100nF  [CAPC1005X55N]
C18  100nF  [CAPC1005X55N]
C19  100nF  [CAPC1005X55N]
C20  100nF  [CAPC1005X55N]
C21  100nF  [CAPC1005X55N]
C22  100nF  [CAPC1005X55N]
C23  4.7uF  [CAPC2012X135N]
C24  10nF  [CAPC1005X55N]
C25  10nF  [CAPC1005X55N]
C26  10nF  [CAPC1005X55N]
IC1  NB6L572MMNG  [QFN50P500X500X100-33N-S325]
L1  120R@100MHz  [INDC1608X65N]
L2  120R@100MHz  [INDC1608X95N]
LD1  Red/Green  [LED_DIALIGHT_571-0112F]  (value not drawn)  (parts A,B of 2)
OSC1  0.2-800MHz  Manufacturer Part Number: 549BACB001937ABG  [OSC_SILICON-LAB_SI549-A]
R1  10k  [RESC1005X40N]
R2  10k  [RESC1005X40N]
R3  0  [RESC1005X40N]
R4  0  [RESC1005X40N]
R5  0  [RESC1005X40N]
R6  200  [RESC1005X40N]
R7  200  [RESC1005X40N]
R8  470  [RESC1005X40N]
R10  220  Tolerance: ±1%  [RESC1005X40N]
R11  220  Tolerance: ±1%  [RESC1005X40N]
T1  2N7002DW  [SOT65P210X110-6N]  (parts A,B of 2)
TP1  (no value)  [TPS127]  (net tie, no BOM)
TP2  (no value)  [TPS127]  (no BOM)
TR1  1:2  [XFMR_MINI-CIRCUITS_AT1521]

### Ports
CK_MMCX_GND, CK_MMCX_IN (in), CLK_SEL0 (in), CLK_SEL1 (in), DAC_CLK (harness CLKDIFF), FMC_REF_CLK0 (harness DIFFCLK), FMC_REF_CLK1 (harness DIFFCLK), FPGA_CLK1 (harness CLKDIFF), OSC_EN (in), OSC_SCL (bidir), OSC_SDA (bidir)

### Harnesses
CLKDIFF: CLK_N, CLK_P
DIFFCLK: CLK_P, CLK_N

### Nets
GND: C1.1 C2.1 C16.1 C17.1 C18.1 C19.1 C20.1 C21.1 C22.1 C23.1 C24.1 C25.1 C26.1 IC1.9(GND) IC1.24(GND) IC1.33(EP) OSC1.3(GND) R6.1 R7.1 T1.1(S2) T1.4(S1)
P3V3: LD1.2(A) LD1.4(A)
P3V3A: L1.1 L2.2
CK_MCX_N: C7.1 TR1.3(S)
CK_MCX_P: C5.1 TR1.1(SDOT)
CLK2_BIDIR_N: C13.1 ; port FMC_REF_CLK0.CLK_N
CLK2_BIDIR_P: C11.1 ; port FMC_REF_CLK0.CLK_P
CLK3_BIDIR_N: C15.1 ; port FMC_REF_CLK1.CLK_N
CLK3_BIDIR_P: C14.1 ; port FMC_REF_CLK1.CLK_P
CLK_SEL0: IC1.15(SEL0) T1.5(G1) ; port CLK_SEL0
CLK_SEL1: IC1.18(SEL1) T1.2(G2) ; port CLK_SEL1
DAC_CLK_N: C12.2 ; port DAC_CLK.CLK_N
DAC_CLK_P: C10.2 ; port DAC_CLK.CLK_P
DCXO_C_N: C4.1 OSC1.5(CLK-) R6.2
DCXO_C_P: C3.1 R4.2 R7.2
HA00_CC_N: C9.2 ; port FPGA_CLK1.CLK_N
HA00_CC_P: C8.2 ; port FPGA_CLK1.CLK_P
SG0: TR1.4(P) ; port CK_MMCX_GND
NetC1_2: C1.2 C2.2 L1.2 OSC1.6(VDD) R1.2 R2.2
NetC3_2: C3.2 IC1.1(IN0)
NetC4_2: C4.2 IC1.4(~{IN0})
NetC5_2: C5.2 IC1.5(IN1)
NetC6_1: C6.1 TR1.6(PDOT)
NetC6_2: C6.2 ; port CK_MMCX_IN
NetC7_2: C7.2 IC1.8(~{IN1})
NetC8_1: C8.1 IC1.12(Q0)
NetC9_1: C9.1 IC1.11(~{Q0})
NetC10_1: C10.1 IC1.22(Q1)
NetC11_2: C11.2 IC1.25(IN2)
NetC12_1: C12.1 IC1.21(~{Q1})
NetC13_2: C13.2 IC1.28(~{IN2})
NetC14_2: C14.2 IC1.29(IN3)
NetC15_2: C15.2 IC1.32(~{IN3})
NetC16_2: C16.2 IC1.2(VT0) IC1.3(VREFAC0)
NetC17_2: C17.2 C18.2 C19.2 C20.2 C21.2 C22.2 C23.2 IC1.10(VCC) IC1.13(VCC) IC1.16(VCC) IC1.17(VCC) IC1.20(VCC) IC1.23(VCC) L2.1
NetC24_2: C24.2 IC1.6(VT1) IC1.7(VREFAC1)
NetC25_2: C25.2 IC1.26(VT2) IC1.27(VREFAC2)
NetC26_2: C26.2 IC1.30(VT3) IC1.31(VREFAC3)
NetIC13_13: R8.1 ; port OSC_EN
NetIC15_5: OSC1.7(SDA) R1.1 TP1.1 ; port OSC_SDA
NetIC15_6: OSC1.8(SCL) R2.1 TP2.1 ; port OSC_SCL
NetLD1_1: LD1.1(C) R10.2
NetLD1_3: LD1.3(C) R11.2
NetOSC1_1: OSC1.1(NC) R5.1
NetOSC1_2: OSC1.2(OE) R3.2
NetOSC1_4: OSC1.4(CLK+) R4.1
NetR3_1: R3.1 R5.2 R8.2
NetR10_1: R10.1 T1.3(D1)
NetR11_1: R11.1 T1.6(D2)

Not connected (* = marked no-connect by the designer): IC1 14(NC)* 19(NC)*; TR1 2(NC)

### Layout directives
differential pair; differential pair class Diff_100Ohm: DCXO_C_N, DCXO_C_P
differential pair: CK_MCX_N, CK_MCX_P, CLK2_BIDIR_N, CLK2_BIDIR_P, CLK3_BIDIR_N, CLK3_BIDIR_P, DAC_CLK_N, DAC_CLK_P, DCXO_C_N, DCXO_C_P, HA00_CC_N, HA00_CC_P
net class Diff_100Ohm: (no net found under the mark)

### Notes on the sheet
- (near C6) clock IN
- Project/Equipment
- Document
- Designer
- Drawn by
- Check.by
- Copyright WUT ISE 2018.
  This documentation describes Open Hardware and is licensed under the CERN OHL v.1.1. You may redistribute and modify this documentation under the terms of the CERN OHL v.1.1. (http://ohwr.org/CERNOHL). This documentation is distributed WITHOUT ANY EXPRESS OR IMPLIED WARRANTY, INCLUDING OF MERCHANTABILITY, SATISFACTORY QUALITY AND FITNESS FOR A PARTICULAR PURPOSE. Please see the CERN OHL v.1.1 for applicable conditions.
- Contact
- File
- Last Mod.
- Print Date
- Sheet
- Size
- A3
- of
- Rev
- (in symbol 2N7002DW, part A) D; G; S
- (in symbol 2N7002DW, part B) D; G; S
- (in symbol LED_DIALIGHT_571-0112F, part A) BOT; Green
- (in symbol LED_DIALIGHT_571-0112F, part B) TOP; Red
- (in symbol R0402_10K_1%_0.0625W_100PPM) 1%
- (in symbol R0402_200R_1%_0.0625W_100PPM) 1%
- (in symbol R0402_470R_1%_0.0625W_100PPM) 1%
- (in symbol XFMR_MINI-CIRCUITS_TC2-72T+) PRI; SEC

### Library data of the parts
C1 = CC0402_1NF_50V_10%_X7R: Non-polarised capacitor; Part Description: SMD Multilayer Chip Ceramic Capacitor; Manufacturer: GENERIC; Manufacturer1 Part Number: 223858715623; Voltage: 50V; TC: X7R; Tolerance: ±10%; Part Number: CC0402_1NF_50V_10%_X7R; Component Kind: Standard; Component Type: Standard; Pin Count: 2; Value: 1nF; Status: Not Recommended; Manufacturer Part Number: CC0402_1NF_50V_10%_X7R; Case: 0402; Mounted: Yes; Socket: No; SMD: Yes; Sense: No; Manufacturer1 Example: PHYCOMP; Manufacturer1 ComponentHeight: 0.55mm; HelpURL: \\cern.ch\dfs\Applications\Altium\Datasheets\CC0402_X7R_PHYCOMP.pdf; Author: CERN DEM JLC; CreateDate: 03.12.2007; LatestRevisionDate: 03.12.2007
C2 C23 = CC0805_4.7UF_10V_10%_X5R: Non-polarised capacitor; Part Description: SMD Multilayer Chip Ceramic Capacitor; Manufacturer: GENERIC; Manufacturer1 Part Number: 222224013672; Voltage: 10V; TC: X5R; Tolerance: ±10%; Part Number: CC0805_4.7UF_10V_10%_X5R; Component Kind: Standard; Component Type: Standard; Pin Count: 2; Value: 4.7uF; Status: Preferred; Manufacturer Part Number: CC0805_4.7UF_10V_10%_X5R; Case: 0805; Mounted: Yes; Socket: No; SMD: Yes; Sense: No; Manufacturer1 Example: PHYCOMP; Manufacturer1 ComponentHeight: 1.45mm; HelpURL: \\cern.ch\dfs\Applications\Altium\Datasheets\CC0805_X5R_PHYCOMP_HC.pdf; Author: CERN DEM JLC; CreateDate: 03.12.2007; LatestRevisionDate: 03.12.2007
C3-C15 = CC0201_100NF_6.3V_10%_X5R: Non-polarised capacitor; Part Description: SMD Multilayer Chip Ceramic Capacitor; Manufacturer: GENERIC; Manufacturer1 Part Number: 02016D104KAT2A; Voltage: 6.3V; TC: X5R; Tolerance: ±10%; Part Number: CC0201_100NF_6.3V_10%_X5R; Component Kind: Standard; Component Type: Standard; Pin Count: 2; Value: 100nF; Status: Not Recommended; Manufacturer Part Number: CC0201_100NF_6.3V_10%_X5R; Case: 0201; Mounted: Yes; Socket: No; SMD: Yes; Sense: No; Manufacturer1 Example: AVX; Manufacturer1 ComponentHeight: 0.33mm; HelpURL: \\cern.ch\dfs\Applications\Altium\Datasheets\CC0201_X5R_AVX.pdf; Author: CERN DEM JLC; CreateDate: 03.12.2007; LatestRevisionDate: 03.12.2007
C16 C24-C26 = CC0402_10NF_16V_10%_X7R: as C109 on sheet FMC_DAC_1_5GS_4CH; Part Number: CC0402_10NF_16V_10%_X7R; Component Kind: Standard; Component Type: Standard; Pin Count: 2; Value: 10nF; Status: Not Recommended; Manufacturer Part Number: CC0402_10NF_16V_10%_X7R; Case: 0402; Mounted: Yes; Socket: No; SMD: Yes; Sense: No; Manufacturer1 Example: PHYCOMP; Manufacturer1 ComponentHeight: 0.55mm; HelpURL: \\cern.ch\dfs\Applications\Altium\Datasheets\CC0402_X7R_PHYCOMP.pdf; Author: CERN DEM JLC; CreateDate: 03.12.2007; LatestRevisionDate: 03.12.2007
C17-C22 = CC0402_100NF_16V_10%_X7R: Non-polarised capacitor; Part Description: SMD Multilayer Chip Ceramic Capacitor; Manufacturer: GENERIC; Manufacturer1 Part Number: GRM155R71C104KA88D; Voltage: 16V; TC: X7R; Tolerance: ±10%; Part Number: CC0402_100NF_16V_10%_X7R; Component Kind: Standard; Component Type: Standard; Pin Count: 2; Value: 100nF; Status: Not Recommended; Manufacturer Part Number: CC0402_100NF_16V_10%_X7R; Case: 0402; Mounted: Yes; Socket: No; SMD: Yes; Sense: No; Manufacturer1 Example: MURATA; Manufacturer1 ComponentHeight: 0.55mm; HelpURL: \\cern.ch\dfs\Applications\Altium\Datasheets\CC0402_X7R_MURATA_GRM.pdf; Author: CERN DEM JLC; CreateDate: 05.12.2013; LatestRevisionDate: 03.12.2007
IC1 = NB6L572MMNG: 2.5V/3.3V Differential 4:1 Mux to 1:2 CML Clock/Data Fanout/Translator; Manufacturer: ON SEMICONDUCTOR; PressFit: No; Bonding: No; Part Number: NB6L572MMNG; Component Kind: Standard; Component Type: Standard; Device: NB6L572MMNG; PackageDescription: QFN, (MO-220-VHHD-4) 0.50mm Pitch, Square; 32 Pin, 5.00mm X 5.00mm X 1.00mm H body (w/Thermal Tab 3.25 X 3.25mm), IPC Medium Density; Part Description: 2.5V/3.3V Differential 4:1 Mux to 1:2 CML Clock/Data Fanout/Translator; Manufacturer Part Number: NB6L572MMNG; Pin Count: 33; Case: QFN32; Mounted: Yes; Socket: No; SMD: Yes; Sense: No; ComponentHeight: 1mm; Author: CERN DEM MR; HelpURL: \\cern.ch\dfs\Applications\Altium\Datasheets\NB6L572MMNG.pdf; CreateDate: 25.01.2018; LatestRevisionDate: 25.01.2018
L1 = IND0603_MURATA_BLM18SG121TN1D: Inductor; Part Description: SMD EMIFIL Suppression Chip Ferrite Bead; Manufacturer: MURATA; Power: 3A; Resistance: 0.025R; Tolerance: ±25%; Part Number: IND0603_MURATA_BLM18SG121TN1D; Component Kind: Standard; Component Type: Standard; Pin Count: 2; Value: 120R@100MHz; Status: None; Manufacturer Part Number: BLM18SG121TN1D; Case: 0603; Mounted: Yes; Socket: No; SMD: Yes; Sense: No; ComponentHeight: 0.65mm; HelpURL: \\cern.ch\dfs\Applications\Altium\Datasheets\IND0603_MURATA_BLM18S.pdf; Author: CERN DEM JLC; CreateDate: 23.07.2014; LatestRevisionDate: 23.07.2014
L2 = IND0603_MURATA_BLM18PG121SN1D: Inductor; Part Description: SMD EMIFIL Chip Ferrite Bead; Manufacturer: MURATA; Power: 2A; Resistance: 0.05R; Part Number: IND0603_MURATA_BLM18PG121SN1D; Component Kind: Standard; Component Type: Standard; Pin Count: 2; Value: 120R@100MHz; Status: None; Manufacturer Part Number: BLM18PG121SN1D; Case: 0603; Mounted: Yes; Socket: No; SMD: Yes; Sense: No; ComponentHeight: 0.95mm; HelpURL: \\cern.ch\dfs\Applications\Altium\Datasheets\IND0603_MURATA_BLM18P.pdf; Author: CERN DEM BC; CreateDate: 2015-07-27; LatestRevisionDate: 2015-07-27
LD1 = LED_DIALIGHT_571-0112F: as LD2 on sheet AWG_PWR_Supply; Part Number: LED_DIALIGHT_571-0112F; Component Kind: Standard; Component Type: Standard; Color: Red/Green; PackageDescription: 2x 2mm LED (Top: Red, Bot: Green) PCB Edge Mounting (Without positioning pins) DIALIGHT 571 Serie; Manufacturer: DIALIGHT; Manufacturer Part Number: 571-0112F; Pin Count: 4; Mounted: Yes; Socket: No; SMD: No; Sense: No; ComponentHeight: 8.6mm; HelpURL: \\cern.ch\dfs\Applications\Altium\Datasheets\LED_DIALIGHT_571-0112F.pdf; Author: CERN DEM JLC; CreateDate: 09.11.2009; LatestRevisionDate: 17.03.2010
OSC1 = OSC_0.2-800MHZ_SILICON-LAB_549BACB001937ABG: Ultra Low Jitter I2C Programmable Crystal Oscillator (XO), Si549 Series; Part Description: 0.2-800MHz, 1.8V/2.5V/3.3V ±20ppm LVDS, Ultra Low Jitter I2C Programmable Crystal Oscillator (XO), Si549 Series; Manufacturer: SILICON LABS; PressFit: No; Bonding: No; Part Number: OSC_0.2-800MHZ_SILICON-LAB_549BACB001937ABG; Component Kind: Standard; Component Type: Standard; PackageDescription: Oscillator Si549 Series, 8 pins, 5x7mm; Value: 0.2-800MHz; Pin Count: 8; Mounted: Yes; Socket: No; SMD: Yes; Sense: No; ComponentHeight: 1.33mm; HelpURL: \\cern.ch\dfs\Applications\Altium\Datasheets\OSC_SILICON-LAB_SI549.pdf; Author: CERN DEM JMW; CreateDate: 27/11/2019; LatestRevisionDate: 02/12/2019
R1 R2 = R0402_10K_1%_0.0625W_100PPM: as R9 on sheet AWG_PWR_Supply; Part Number: R0402_10K_1%_0.0625W_100PPM; Component Kind: Standard; Component Type: Standard; Pin Count: 2; Value: 10k; Status: Not recommended; Power: 0.0625W; Tolerance: ±1%; Manufacturer Part Number: R0402_10K_1%_0.0625W_100PPM; Case: 0402; Mounted: Yes; Socket: No; SMD: Yes; Manufacturer1 Example: YAGEO PHYCOMP; Manufacturer1 ComponentHeight: 0.4mm; HelpURL: \\cern.ch\dfs\Applications\Altium\Datasheets\R0402_Phycomp_RC0402.pdf; Author: CERN DEM JLC; CreateDate: 3/12/2007; LatestRevisionDate: 17/10/2012
R3-R5 = R0402_0R_JUMPER: Resistor; Part Description: 1A (0.05R Max DC Resistance) Zero Ohm Jumper; Manufacturer: GENERIC; Manufacturer1 Part Number: 232270591001L; PressFit: No; Part Number: R0402_0R_JUMPER; Component Kind: Standard; Component Type: Standard; Pin Count: 2; Value: 0; Status: Not Recommended; Manufacturer Part Number: R0402_0R_JUMPER; Case: 0402; Mounted: Yes; Sense: No; Socket: No; SMD: Yes; Manufacturer1 Example: YAGEO PHYCOMP; Manufacturer1 ComponentHeight: 0.4mm; HelpURL: \\cern.ch\dfs\Applications\Altium\Datasheets\R0402_Phycomp_RC0402.pdf; Author: CERN DEM JLC; CreateDate: 03.12.2007; LatestRevisionDate: 17.10.2012
R6 R7 = R0402_200R_1%_0.0625W_100PPM: Resistor - 1%; Part Description: General Purpose Thick Film Chip Resistor; Manufacturer: GENERIC; Manufacturer1 Part Number: 232270672001L; TC: ±100ppm/°C; PressFit: No; Part Number: R0402_200R_1%_0.0625W_100PPM; Component Kind: Standard; Component Type: Standard; Pin Count: 2; Value: 200; Status: Not Recommended; Power: 0.0625W; Tolerance: ±1%; Manufacturer Part Number: R0402_200R_1%_0.0625W_100PPM; Case: 0402; Mounted: Yes; Sense: No; Socket: No; SMD: Yes; Manufacturer1 Example: YAGEO PHYCOMP; Manufacturer1 ComponentHeight: 0.4mm; HelpURL: \\cern.ch\dfs\Applications\Altium\Datasheets\R0402_Phycomp_RC0402.pdf; Author: CERN DEM JLC; CreateDate: 03.12.2007; LatestRevisionDate: 17.10.2012
R8 = R0402_470R_1%_0.0625W_100PPM: as R41 on sheet FMC_DAC_1_5GS_4CH; Part Number: R0402_470R_1%_0.0625W_100PPM; Component Kind: Standard; Component Type: Standard; Pin Count: 2; Value: 470; Status: Not Recommended; Power: 0.0625W; Tolerance: ±1%; Manufacturer Part Number: R0402_470R_1%_0.0625W_100PPM; Case: 0402; Mounted: Yes; Sense: No; Socket: No; SMD: Yes; Manufacturer1 Example: YAGEO PHYCOMP; Manufacturer1 ComponentHeight: 0.4mm; HelpURL: \\cern.ch\dfs\Applications\Altium\Datasheets\R0402_Phycomp_RC0402.pdf; Author: CERN DEM JLC; CreateDate: 03.12.2007; LatestRevisionDate: 17.10.2012
R10 R11 = R0402_220R_1%_0.0625W_100PPM: as R28 on sheet AWG_PWR_Supply; Part Number: R0402_220R_1%_0.0625W_100PPM; Component Kind: Standard; Component Type: Standard; Pin Count: 2; Value: 220; Status: Not Recommended; Power: 0.0625W; Manufacturer Part Number: R0402_220R_1%_0.0625W_100PPM; Case: 0402; Mounted: Yes; Sense: No; Socket: No; SMD: Yes; Manufacturer1 Example: YAGEO PHYCOMP; Manufacturer1 ComponentHeight: 0.4mm; HelpURL: \\cern.ch\dfs\Applications\Altium\Datasheets\R0402_Phycomp_RC0402.pdf; Author: CERN DEM JLC; CreateDate: 03.12.2007; LatestRevisionDate: 17.10.2012
T1 = 2N7002DW: as T2 on sheet AWG_PWR_Supply; Part Number: 2N7002DW; Component Kind: Standard; Component Type: Standard; Device: 2N7002DW; PackageDescription: SOT363, SC70-6, 0.65mm Pitch; 6 Pin, 1.25mm W X 2.00mm L X 1.10mm H body, IPC Medium Density; Manufacturer Part Number: 2N7002DW; Pin Count: 6; Case: SOT363; Mounted: Yes; Socket: No; SMD: Yes; Sense: No; ComponentHeight: 1.1mm; HelpURL: \\cern.ch\dfs\Applications\Altium\Datasheets\2N7002DW.pdf; Author: CERN DEM BC; CreateDate: 25.11.2020; LatestRevisionDate: 25.11.2020
TP1 TP2 = SMD_PAD_1.27X1.27MM: Test Point; Part Description: 1.27mm x 1.27mm PCB Copper Area (SMD Test Point); Mounted: No; Part Number: SMD_PAD_1.27X1.27MM; Component Type: Standard (No BOM); Pin Count: 1; Family: Test Point; Socket: No; SMD: Yes; Sense: No; Status: None; ComponentHeight: 0mm; HelpURL: Undefined; Author: CERN DEM JLC; CreateDate: 12.01.2008; LatestRevisionDate: 12.01.2008; PackageDescription: 1.27mm x 1.27mm PCB Copper Area (SMD Test Point)
TR1 = XFMR_MINI-CIRCUITS_TC2-72T+: 50 Ohms 10 to 700 MHzz RF Transformer; Part Description: 50 Ohms 10 to 700MHz RF Transformer; Manufacturer: MINI-CIRCUITS; Manufacturer Part Number: TC2-72T+; HelpURL: \\cern.ch\dfs\Applications\Altium\Datasheets\XFMR_MINI-CIRCUITS_TC2-1TX+.pdf; Part Number: XFMR_MINI-CIRCUITS_TC2-72T+; Component Kind: Standard; Component Type: Standard; Pin Count: 5; Value: 1:2; Status: None; Mounted: Yes; Socket: No; Sense: No; SMD: Yes; ComponentHeight: 4.06mm; Author: GK; CreateDate: 18.10.2019; LatestRevisionDate: 18.10.2019